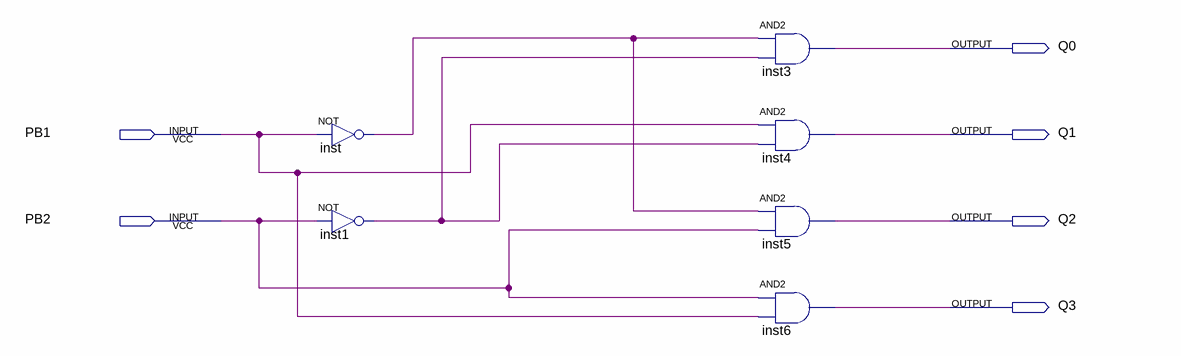
[diagram p0: schematic sheet]
// Quartus schematic Lab1_Exercise1.bdf as structural Verilog: 6 symbols, 6 pins
module Lab1_Exercise1 (
  input  PB1,
  input  PB2,
  output Q0,
  output Q1,
  output Q2,
  output Q3
);

  wire inst1_out, inst_out;

  not inst (inst_out, PB1);
  not inst1 (inst1_out, PB2);
  and inst3 (Q0, inst_out, inst1_out);
  and inst4 (Q1, PB1, inst1_out);
  and inst5 (Q2, inst_out, PB2);
  and inst6 (Q3, PB2, PB1);
endmodule
